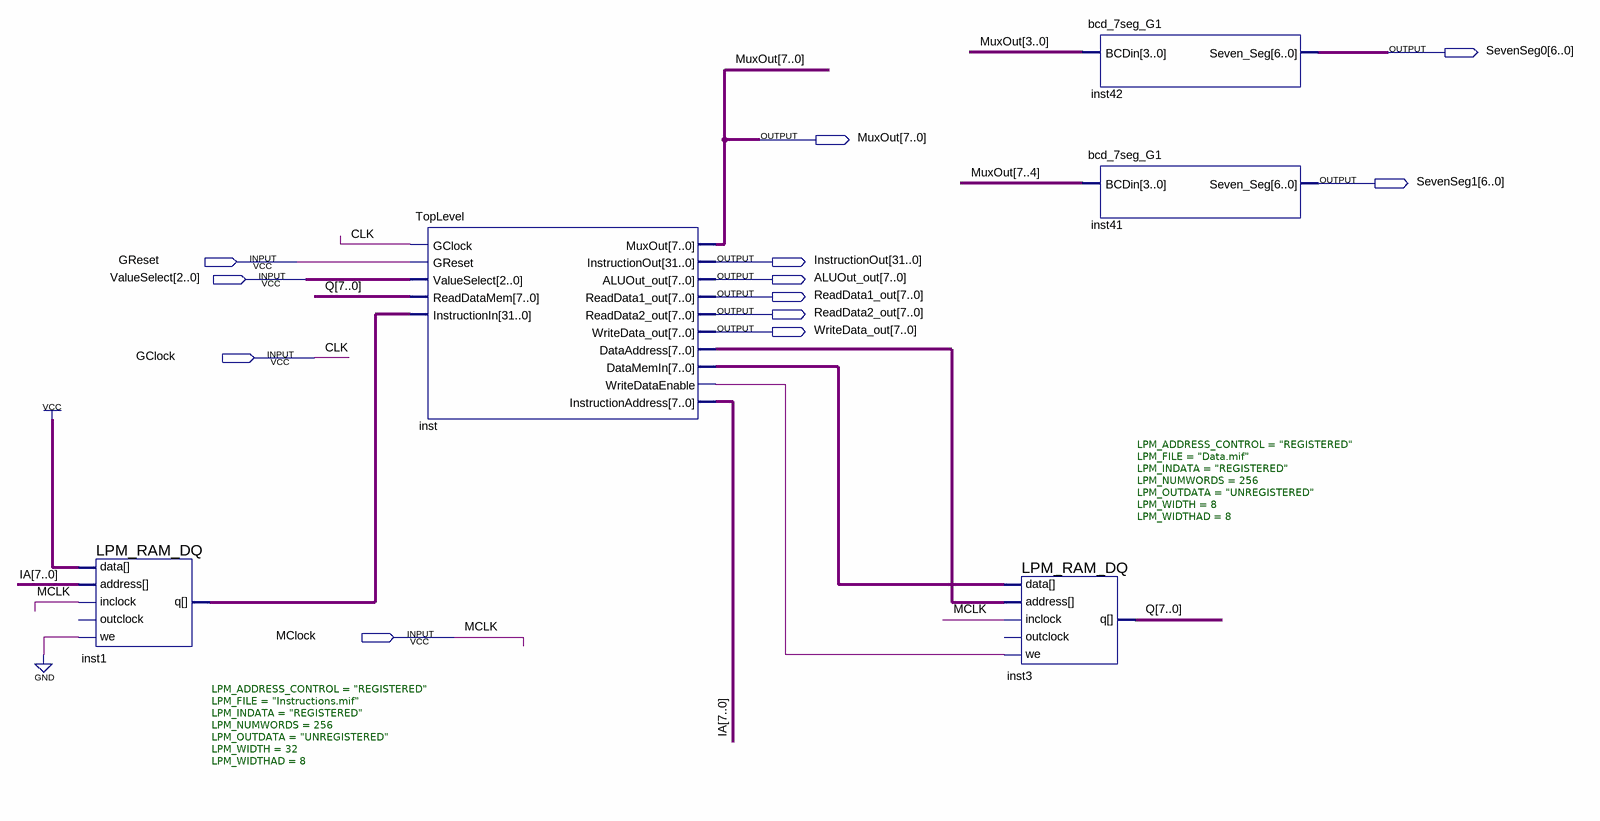
[diagram p0: schematic sheet]
// Quartus schematic Lab2.bdf as structural Verilog: 5 symbols, 12 pins
module Lab2 (
  input  GReset,
  input  [2:0] ValueSelect,
  input  GClock,
  input  MClock,
  output [6:0] SevenSeg0,
  output [7:0] MuxOut,
  output [6:0] SevenSeg1,
  output [31:0] InstructionOut,
  output [7:0] ALUOut_out,
  output [7:0] ReadData1_out,
  output [7:0] ReadData2_out,
  output [7:0] WriteData_out
);

  wire inst_writedataenable;
  wire [7:0] IA, inst_dataaddress, inst_datamemin, Q;
  wire [31:0] inst1_q;

  LPM_RAM_DQ #(.LPM_ADDRESS_CONTROL("REGISTERED"), .LPM_FILE("Instructions.mif"), .LPM_INDATA("REGISTERED"), .LPM_NUMWORDS(256), .LPM_OUTDATA("UNREGISTERED"), .LPM_WIDTH(32), .LPM_WIDTHAD(8)) inst1 (
    .inclock(MClock), .data({32{1'b1}}), .address(IA), .we(1'b0), .q(inst1_q));  // open: outclock
  TopLevel inst (
    .GClock(GClock), .GReset(GReset), .ValueSelect(ValueSelect), .ReadDataMem(Q), .InstructionIn(inst1_q),
    .MuxOut(MuxOut), .InstructionOut(InstructionOut), .ALUOut_out(ALUOut_out), .ReadData1_out(ReadData1_out),
    .ReadData2_out(ReadData2_out), .WriteData_out(WriteData_out), .DataAddress(inst_dataaddress),
    .DataMemIn(inst_datamemin), .WriteDataEnable(inst_writedataenable), .InstructionAddress(IA));
  LPM_RAM_DQ #(.LPM_ADDRESS_CONTROL("REGISTERED"), .LPM_FILE("Data.mif"), .LPM_INDATA("REGISTERED"), .LPM_NUMWORDS(256), .LPM_OUTDATA("UNREGISTERED"), .LPM_WIDTH(8), .LPM_WIDTHAD(8)) inst3 (
    .inclock(MClock), .data(inst_datamemin), .address(inst_dataaddress), .we(inst_writedataenable), .q(Q));  // open: outclock
  bcd_7seg_G1 inst42 (.BCDin(MuxOut[3:0]), .Seven_Seg(SevenSeg0));
  bcd_7seg_G1 inst41 (.BCDin(MuxOut[7:4]), .Seven_Seg(SevenSeg1));

  // Other names for the same wires on the sheet: CLK = GClock; MCLK = MClock
endmodule
